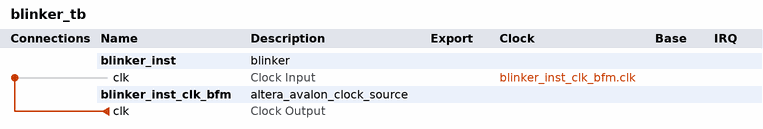
[diagram p0: system contents]
# Platform Designer (Qsys) system blinker_tb, Cyclone IV GX Unknown
# Parameters at their usual value, and those the tool derives, are not listed.
package require -exact qsys 13.0
create_system blinker_tb
set_project_property DEVICE_FAMILY {Cyclone IV GX}
set_project_property DEVICE Unknown

add_instance blinker_inst blinker 1.0

add_instance blinker_inst_clk_bfm altera_avalon_clock_source 13.0

# connections
add_connection blinker_inst_clk_bfm.clk blinker_inst.clk clock

set_interconnect_requirement {$system} qsys_mm.clockCrossingAdapter HANDSHAKE
set_interconnect_requirement {$system} qsys_mm.maxAdditionalLatency 1

save_system blinker_tb.qsys
